# EasyEDA Pro project LedKeychain.eprj

# Schematic Schematic1
Board Name: Board1; Create Date: 2025-04-13; Page Name: P1; Project Name: MatrixLedKeychain; Schematic Name: Schematic1; Update Date: 2025-08-01; Company: EasyEDA.com; Page Size: A4; Version: V1.0
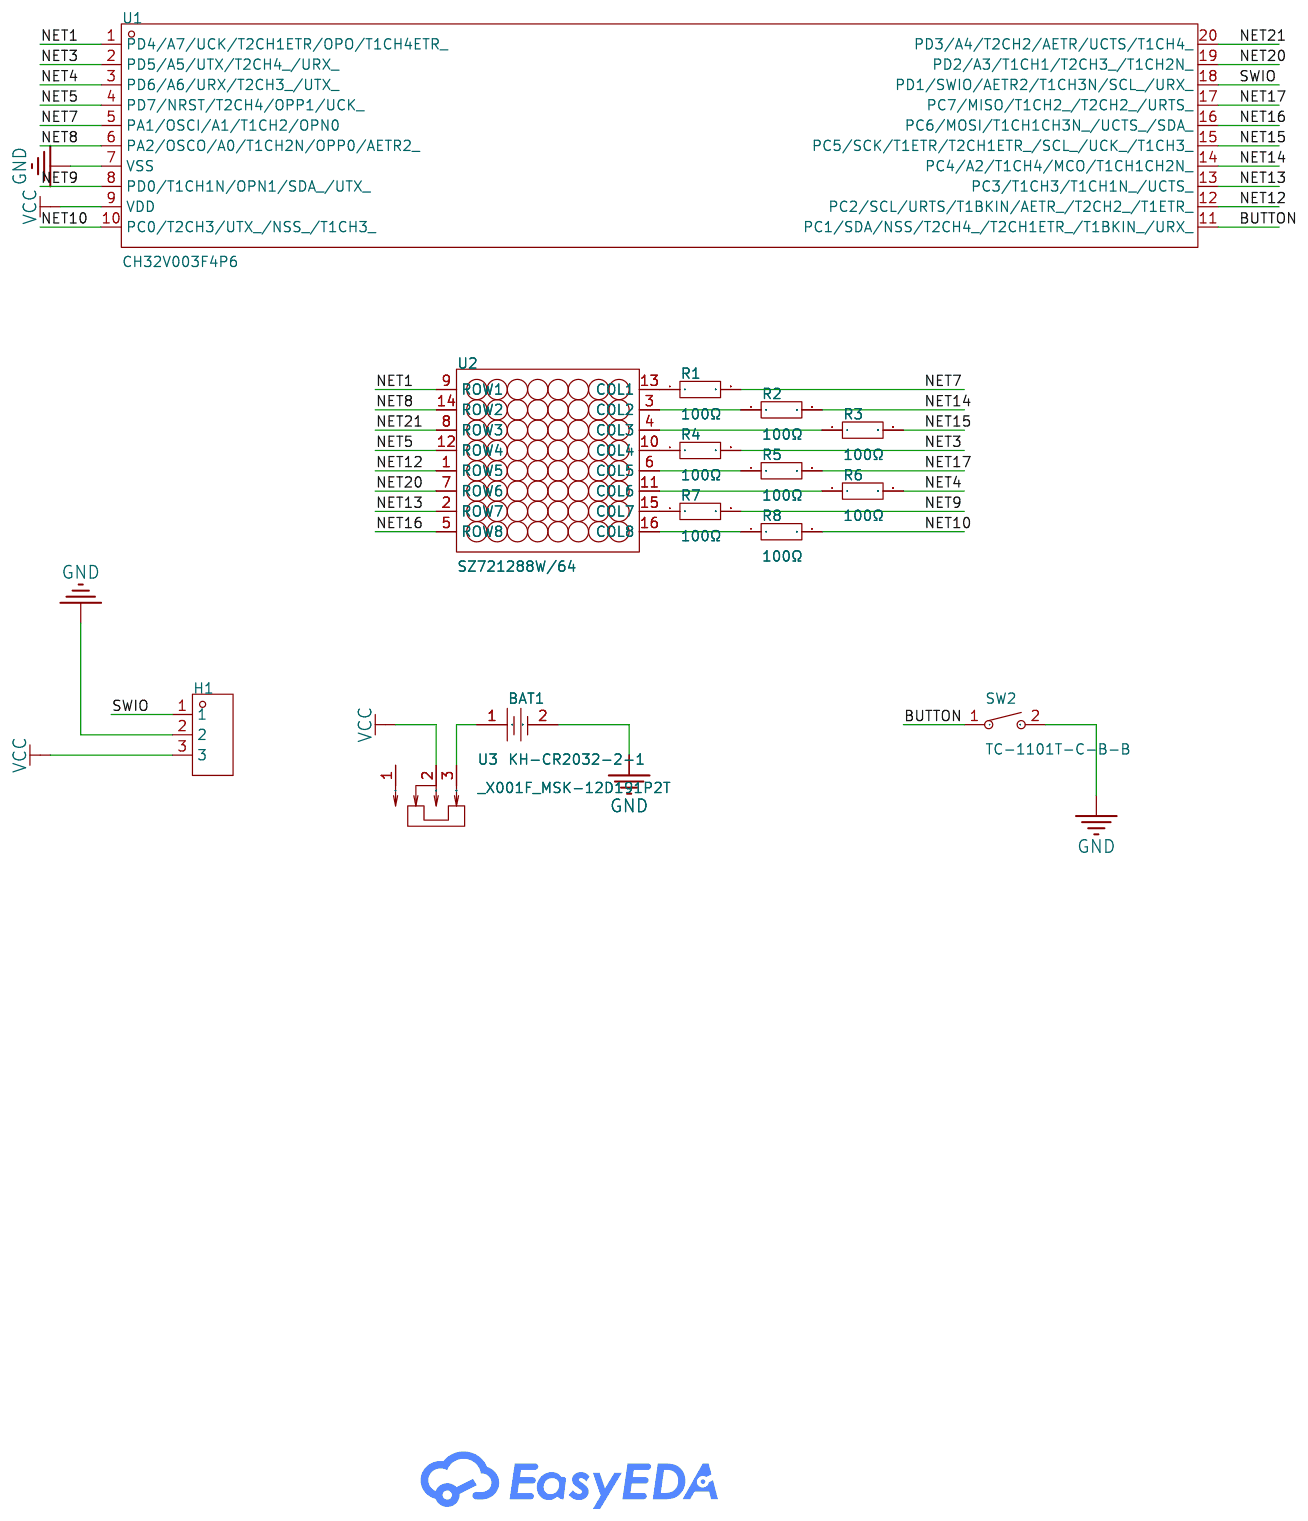
[diagram p0: schematic sheet]

## Parts
BAT1  KH-CR2032-2-1  [BAT-TH_KH-CR2032-2-1]
H1  -  [HDR-TH_3P-P2.54-V-M]
R1  100Ω  [R0805]
R2  100Ω  [R0805]
R3  100Ω  [R0805]
R4  100Ω  [R0805]
R5  100Ω  [R0805]
R6  100Ω  [R0805]
R7  100Ω  [R0805]
R8  100Ω  [R0805]
SW2  TC-1101T-C-B-B  [KEY-TH_2P-L6.0-W3.5-P6.50]
U1  CH32V003F4P6  [TSSOP-20_L6.5-W4.4-P0.65-LS6.4-BL]
U2  SZ721288W/64  [LED-SEG-TH_SZ421288N-64]
U3  _X001F_MSK-12D191P2T  [SW-TH_MSK-12D191P2T]

## Library data of the parts
BAT1 = KH-CR2032-2-1: Supplier Part: C5365915; Manufacturer: kinghelm(金航标); JLCPCB Part Class: Extended Part; Datasheet: https://atta.szlcsc.com/upload/public/pdf/source/20230301/F3ED62C53898C1F99BC47B7A2E148BA2.pdf; Supplier: LCSC
H1 = HDR-M_2.54_1x3P: Supplier Footprint: Through
R1-R8 = 0805W8F1002T5E: LCSC Part Name: 10kΩ ±1% 125mW 厚膜电阻; Supplier Part: C17414; Manufacturer: UNI-ROYAL(厚声); Supplier Footprint: 0805; JLCPCB Part Class: Basic Part; Datasheet: https://atta.szlcsc.com/upload/public/pdf/source/20200306/C422600_1E6D84923E4A46A82E41ADD87F860B5C.pdf; Supplier: LCSC; Type: Thick Film Resistors; Tolerance: ±1%; Temperature Coefficient: ±100ppm/℃; Operating Temperature Range: -55℃~+155℃
SW2 = TC-1101T-C-B-B: LCSC Part Name: 6*3.5*5mm 直插 轻触开关; Supplier Part: C500068; Manufacturer: XKB Connectivity(中国星坤); Supplier Footprint: 插件; JLCPCB Part Class: Extended Part; Datasheet: https://atta.szlcsc.com/upload/public/pdf/source/20211011/B69A8CD93B4DADD1FF98516D35420DE2.pdf; Supplier: LCSC; Circuit: SPST; Actuator Style: Rectangle button; Operating Force: 260gf; Mounting Style: Straight; Switch Length: 6mm; Switch Width: 3.5mm; Switch Height: 5mm; Strike Gundam: 不带; Contact Current: 50mA; Voltage Rating (DC): 12V; Actuator/Cap Color: Black; With Lamp: No; Pin Style: PCPin; Mechanical Life: 5万次; Operating Temperature: -20℃~+70℃
U1 = CH32V003F4P6: Supplier Part: C5187096; Manufacturer: WCH(南京沁恒); Supplier Footprint: TSSOP-20-175mil; JLCPCB Part Class: Extended Part; Datasheet: https://atta.szlcsc.com/upload/public/pdf/source/20240313/7AE96B00B31D73B13B4275FFAA3D04F3.pdf; Supplier: LCSC
U2 = SZ721288W/64: LCSC Part Name: 8x8位共阴极白色LED点阵; Supplier Part: C2980924; Manufacturer: ARKLED(方舟); Supplier Footprint: 插件; JLCPCB Part Class: Extended Part; Datasheet: https://atta.szlcsc.com/upload/public/pdf/source/20220310/02C92D6EC4802147600AB7D5BBA1ACF2.pdf; Supplier: LCSC; Dot Matrix Number: 8x8; Emitting Color: White; Polarity: Common Cathode
U3 = MSK-12D19: Supplier: LCSC; Supplier Part: C9900016029; Manufacturer: null; Manufacturer Part: _x001F_MSK-12D191P2T; JLCPCB Part Class: Extended Part

## Nets
GND: BAT1.2 H1.2 SW2.2 U1.7(VSS)
VCC: H1.3 U1.9(VDD) U3.2
BUTTON: SW2.1 U1.11(PC1/SDA/NSS/T2CH4_/T2CH1ETR_/T1BKIN_/URX_)
NET1: U1.1(PD4/A7/UCK/T2CH1ETR/OPO/T1CH4ETR_) U2.9(ROW1)
NET3: R4.2 U1.2(PD5/A5/UTX/T2CH4_/URX_)
NET4: R6.2 U1.3(PD6/A6/URX/T2CH3_/UTX_)
NET5: U1.4(PD7/NRST/T2CH4/OPP1/UCK_) U2.12(ROW4)
NET7: R1.2 U1.5(PA1/OSCI/A1/T1CH2/OPN0)
NET8: U1.6(PA2/OSCO/A0/T1CH2N/OPP0/AETR2_) U2.14(ROW2)
NET9: R7.2 U1.8(PD0/T1CH1N/OPN1/SDA_/UTX_)
NET10: R8.2 U1.10(PC0/T2CH3/UTX_/NSS_/T1CH3_)
NET12: U1.12(PC2/SCL/URTS/T1BKIN/AETR_/T2CH2_/T1ETR_) U2.1(ROW5)
NET13: U1.13(PC3/T1CH3/T1CH1N_/UCTS_) U2.2(ROW7)
NET14: R2.2 U1.14(PC4/A2/T1CH4/MCO/T1CH1CH2N_)
NET15: R3.2 U1.15(PC5/SCK/T1ETR/T2CH1ETR_/SCL_/UCK_/T1CH3_)
NET16: U1.16(PC6/MOSI/T1CH1CH3N_/UCTS_/SDA_) U2.5(ROW8)
NET17: R5.2 U1.17(PC7/MISO/T1CH2_/T2CH2_/URTS_)
NET20: U1.19(PD2/A3/T1CH1/T2CH3_/T1CH2N_) U2.7(ROW6)
NET21: U1.20(PD3/A4/T2CH2/AETR/UCTS/T1CH4_) U2.8(ROW3)
SWIO: H1.1 U1.18(PD1/SWIO/AETR2/T1CH3N/SCL_/URX_)
$1N1721: R2.1 U2.3(COL2)
$1N1762: R3.1 U2.4(COL3)
$1N1803: R4.1 U2.10(COL4)
$1N1844: R5.1 U2.6(COL5)
$1N1883: R6.1 U2.11(COL6)
$1N1963: R8.1 U2.16(COL8)
$1N1971: R1.1 U2.13(COL1)
$1N1973: R7.1 U2.15(COL7)
$1N4267: BAT1.1 U3.3

Not connected (* = marked no-connect by the designer): U3 1

# Board PCB1
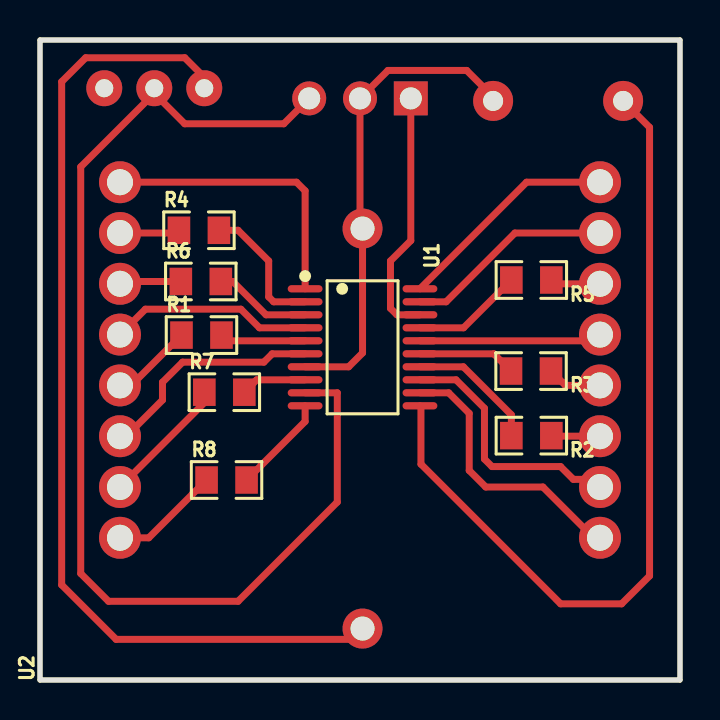
[diagram p1: board, top side]
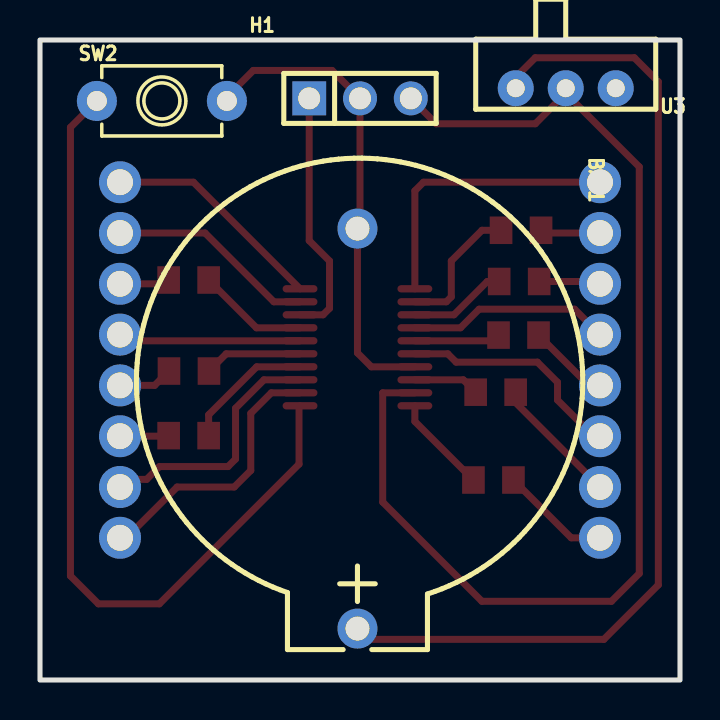
[diagram p2: board, bottom side, seen from below]

Outline 32 x 32 mm; copper layers: Top Layer, Bottom Layer. Coordinates in mm from the lower left corner of the outline.
Outline path: rectangle 0,32 32,0
Stack: Top Layer 0.035mm / Dielectric1 1.51mm FR4 er 4.5 / Bottom Layer 0.035mm

## Design rules (mm)
template: Custom Config
spacing copperThickness1oz (default): track to track 0.102, other pairs 0.152 to 0.3
spacing copperThickness2oz: track to track 0.203, other pairs 0.152 to 0.3
track width copperThickness1oz (default): min 0.127, default 0.35, max 2.54
track width copperThickness2oz: min 0.203, default 0.254, max 2.54
differential pair differentialPair (default): width min 0.127, default 0.254, max 2.54; gap min 0.152, default 0.152
via viaSize (default): diameter min 0.5, default 0.61, max 10; hole min 0.3, default 0.305, max 6.3

## Placement (name value [footprint] x y rotation side)
BAT1  KH-CR2032-2-1  [BAT-TH_KH-CR2032-2-1]  16.13 12.57 270 bottom
H1  -  [HDR-TH_3P-P2.54-V-M]  16 29.08 180 bottom
R1  100Ω  [R0805]  8.07 17.25 0 top
R2  100Ω  [R0805]  24.57 12.22 180 top
R3  100Ω  [R0805]  24.55 15.45 180 top
R4  100Ω  [R0805]  7.95 22.49 0 top
R5  100Ω  [R0805]  24.57 20 180 top
R6  100Ω  [R0805]  8.04 19.93 0 top
R7  100Ω  [R0805]  9.22 14.39 0 top
R8  100Ω  [R0805]  9.33 10 0 top
SW2  TC-1101T-C-B-B  [KEY-TH_2P-L6.0-W3.5-P6.50]  25.91 28.95 180 bottom
U1  CH32V003F4P6  [TSSOP-20_L6.5-W4.4-P0.65-LS6.4-BL]  16.13 16.64 270 top
U2  SZ721288W/64  [LED-SEG-TH_SZ421288N-64]  16 16 90 top
U3  _X001F_MSK-12D191P2T  [SW-TH_MSK-12D191P2T]  5.71 29.59 0 bottom

## Footprints (pads in the part's own frame, mm; a bottom-side part is the same pattern mirrored in y, then rotated)
BAT-TH_KH-CR2032-2-1
  round 2 hole 1.2x0.9: 1(10,0) 2(-10,0)
HDR-TH_3P-P2.54-V-M
  rect 1.7x1.7 hole 1.1x0.8: 1(-2.54,0)
  round 1.7 hole 1.1x0.8: 2(0,0) 3(2.54,0)
KEY-TH_2P-L6.0-W3.5-P6.50
  round 2 hole 1: 1(-3.25,0) 2(3.25,0)
LED-SEG-TH_SZ421288N-64
  round 2.1 hole 1.3: 1(-8.89,-12) 2(-6.35,-12) 3(-3.81,-12) 4(-1.27,-12) 5(1.27,-12) 6(3.81,-12) 7(6.35,-12) 8(8.89,-12) 9(8.89,12) 10(6.35,12) 11(3.81,12) 12(1.27,12) 13(-1.27,12) 14(-3.81,12) 15(-6.35,12) 16(-8.89,12)
R0805
  rect 1.133x1.377 smd: 1(-1,0) 2(1,0)
SW-TH_MSK-12D191P2T
  round 1.8 hole 0.9x0.8: 1(-2.5,0) 2(0,0) 3(2.5,0)
TSSOP-20_L6.5-W4.4-P0.65-LS6.4-BL
  oval 0.364x1.742 smd: 1(-2.925,-2.871) 2(-2.275,-2.871) 3(-1.625,-2.871) 4(-0.975,-2.871) 5(-0.325,-2.871) 6(0.325,-2.871) 7(0.975,-2.871) 8(1.625,-2.871) 9(2.275,-2.871) 10(2.925,-2.871) 11(2.925,2.871) 12(2.275,2.871) 13(1.625,2.871) 14(0.975,2.871) 15(0.325,2.871) 16(-0.325,2.871) 17(-0.975,2.871) 18(-1.625,2.871) 19(-2.275,2.871) 20(-2.925,2.871)

## Nets
As in the schematic.

Pads without a net: U3 1

## Routing (per net, layer and track width the routed paths; a pad name or vN(x,y) marks a point on that pad's centre or on a via; arc(x,y) is an arc through that point)
GND: length 23.9
  Top Layer w0.35: 13.26,15.66 15.43,15.66 16.13,16.35 BAT1.2 16,22.7 H1.2 17.4,30.48 21.33,30.48 22.66,29.16 SW2.2
VCC: length 57.2
  Top Layer w0.35: H1.3 12.19,27.81 7.24,27.81 5.71,29.34 ; 5.71,29.34 U3.2 ; 5.71,29.34 2.04,25.66 2.04,5.33 3.43,3.94 9.9,3.94 14.86,8.9 14.86,14.36 13.26,14.36
BUTTON: length 42.1
  Top Layer w0.35: U1.11 19.05,13.66 19.05,10.79 26.03,3.81 29.08,3.81 30.48,5.2 30.48,27.63 SW2.1
NET1: length 14.3
  Top Layer w0.35: 13.26,19.56 13.26,24.46 12.82,24.89 U2.9
NET3: length 6.8
  Top Layer w0.35: R4.2 9.9,22.49 11.43,20.95 11.43,19.16 11.68,18.91 13.26,18.91
NET4: length 4.9
  Top Layer w0.35: R6.2 9.64,19.93 11.3,18.26 13.26,18.26
NET5: length 10.2
  Top Layer w0.35: U2.12 5.27,18.54 10.04,18.54 10.97,17.61 13.26,17.61
NET7: length 4.3
  Top Layer w0.35: 13.26,16.96 9.36,16.96 R1.2
NET8: length 11.5
  Top Layer w0.35: U2.14 4.32,12.19 6.12,14 6.12,14.89 7.13,15.89 11.19,15.89 11.61,16.31 13.26,16.31
NET9: length 3.3
  Top Layer w0.35: 13.26,15.01 10.84,15.01 R7.2
NET10: length 4.9
  Top Layer w0.35: 13.26,13.71 13.26,12.93 R8.2
NET12: length 13.7
  Top Layer w0.35: U1.12 20.43,14.36 21.46,13.33 21.46,10.48 22.29,9.65 25.14,9.65 27.68,7.11 U2.1
NET13: length 12.7
  Top Layer w0.35: U1.13 20.8,15.01 22.22,13.59 22.22,11.05 22.6,10.67 26.03,10.67 26.67,10.03 27.62,10.03 U2.2
NET14: length 6.6
  Top Layer w0.35: U1.14 21.17,15.66 23.57,13.26 R2.2
NET15: length 4.9
  Top Layer w0.35: R3.2 22.69,16.31 U1.15
NET16: length 9.1
  Top Layer w0.35: U2.5 27.69,16.96 U1.16
NET17: length 5.6
  Top Layer w0.35: U1.17 21.18,17.61 R5.2
NET20: length 10.4
  Top Layer w0.35: U2.7 23.75,22.35 20.31,18.91 U1.19
NET21: length 11.2
  Top Layer w0.35: U1.20 24.33,24.89 U2.8
SWIO: length 12.5
  Top Layer w0.35: U1.18 17.85,18.26 17.52,18.58 17.52,20.95 18.54,21.97 H1.1
$1N1721: length 2.4
  Top Layer w0.35: U2.3 25.6,12.19 R2.1
$1N1762: length 2.7
  Top Layer w0.35: R3.1 26.27,14.73 U2.4
$1N1803: length 3
  Top Layer w0.35: U2.10 6.81,22.35 R4.1
$1N1844: length 2.5
  Top Layer w0.35: U2.6 25.76,19.81 R5.1
$1N1883: length 2.8
  Top Layer w0.35: 6.79,19.93 4.12,19.93 U2.11
$1N1963: length 5.5
  Top Layer w0.35: R8.1 5.44,7.11 U2.16
$1N1971: length 4.1
  Top Layer w0.35: R1.1 4.56,14.73 U2.13
$1N1973: length 6.5
  Top Layer w0.35: R7.1 8.22,13.87 U2.15
$1N4267: length 50.1
  Top Layer w0.35: U3.3 8.21,30.14 7.24,31.11 2.28,31.11 1.08,29.91 1.08,4.75 3.81,2.03 15.59,2.03 BAT1.1
